# EAGLE design Colon (EAGLE 9.6.2)
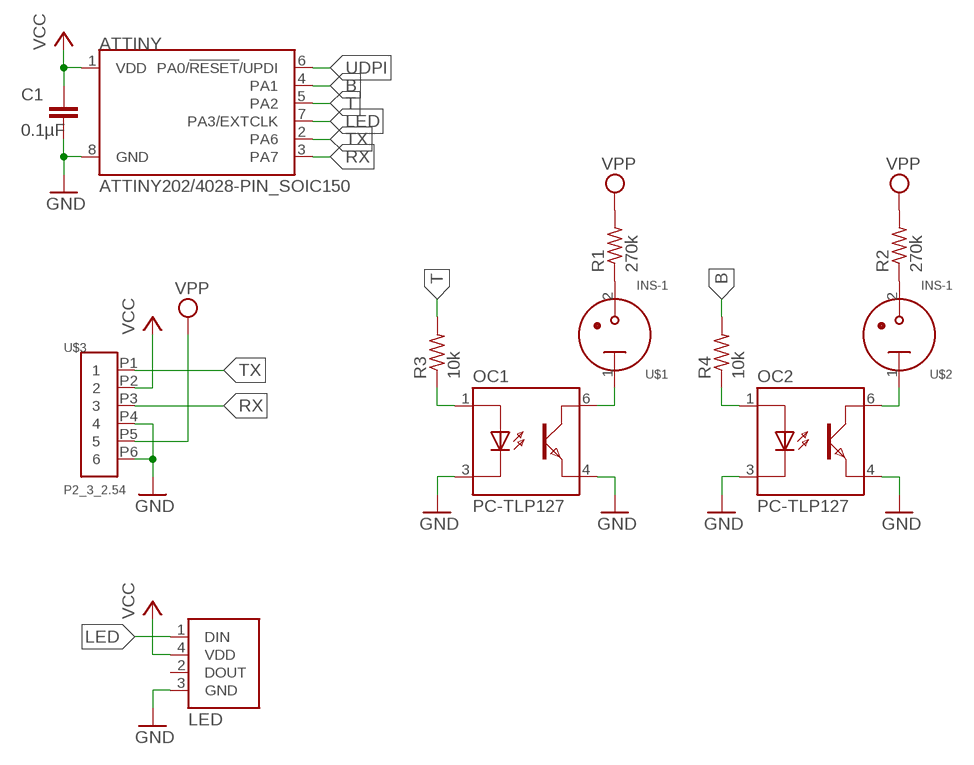
[diagram p0: schematic, sheet 1]

## Parts
ATTINY  ATTINY202/4028-PIN_SOIC150  [SOIC127P600X175-8N]
C1  0.1µF  C-EUC0603  [C0603]
LED  SK6812SIDE  [SK6812SIDE]
OC1  PC-TLP127  [MINIFLAT4]
OC2  PC-TLP127  [MINIFLAT4]
R1  270k  R-US_R0603  [R0603]
R2  270k  R-US_R0603  [R0603]
R3  10k  R-US_R0603  [R0603]
R4  10k  R-US_R0603  [R0603]
U$1  INS-1  [INS-1]
U$2  INS-1  [INS-1]
U$3  P2_3_2.54  [P2_3_2.54]

## Nets
B: ATTINY.4(PA1) R4.2
GND: ATTINY.8(GND) C1.2 LED.3(GND) OC1.3(C) OC1.4(TE) OC2.3(C) OC2.4(TE) U$3.P4 U$3.P6
LED: ATTINY.7(PA3/EXTCLK) LED.1(DIN)
N$1: R1.1 U$1.2(C)
N$2: R2.1 U$2.2(C)
N$3: OC1.6(TC) U$1.1(A)
N$4: OC2.6(TC) U$2.1(A)
N$7: OC2.1(A) R4.1
N$8: OC1.1(A) R3.1
RX: ATTINY.3(PA7) U$3.P3
T: ATTINY.5(PA2) R3.2
TX: ATTINY.2(PA6) U$3.P1
UDPI: ATTINY.6(PA0/!RESET!/UPDI)
VCC: ATTINY.1(VDD) C1.1 LED.4(VDD) U$3.P2
VPP: R1.2 R2.2 U$3.P5
Unconnected: LED.2(DOUT)

## Library data of the parts
ATTINY = microcontrollers:ATTINY202/402
C1 = rcl:C-EU: CAPACITOR, European symbol; SPICEPREFIX: C
LED = chip:SK6812SIDE
OC1 OC2 = we-opto:PC: Photocoupler / Photointerrupter TLP127 compatible with TLP187 and LTV-352T; DIGIKEY: TLP127FDKR-ND
R1-R4 = rcl:R-US_: RESISTOR, American symbol; SPICEPREFIX: R
U$1 U$2 = nixie-tube:INS-1
U$3 = pins:P2_3_2.54

## Board
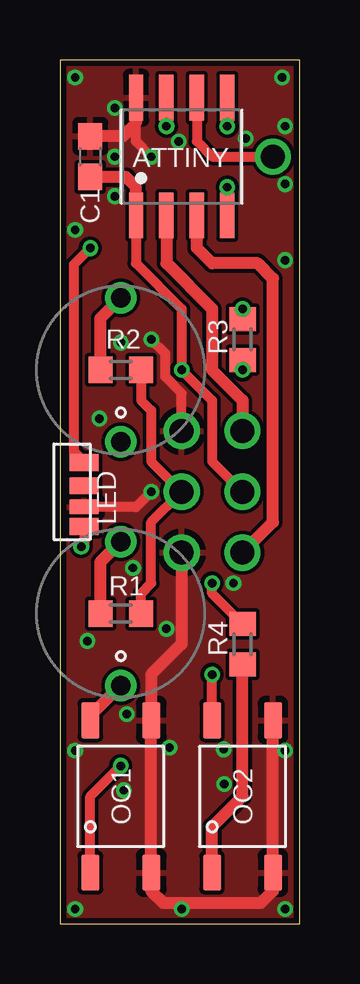
[diagram p1: board, top side]
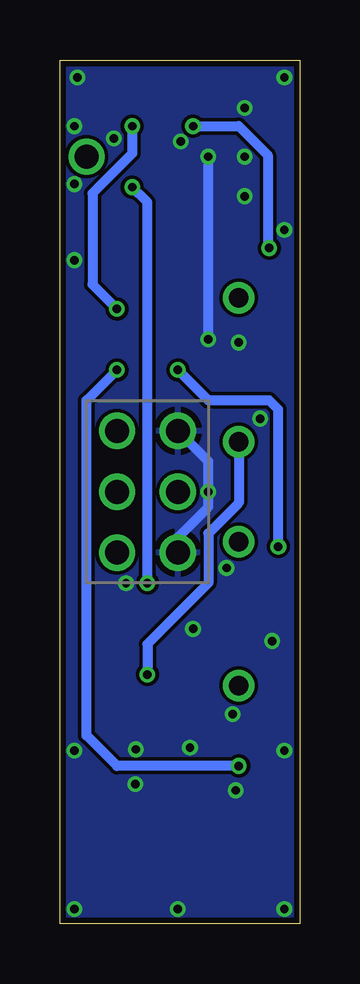
[diagram p2: board, bottom side, seen from below]

Size 10 x 36 mm. Coordinates in mm from the lower left corner, seen from the top.
Outline: 0,0 10,0 10,36 0,36 0,0
Copper layers (1*16): Top 0.035mm / dielectric 1.5mm / Bottom 0.035mm
Design rules "SeeedStudio_2layer_DRU_no_angle_20140221": minimum track width 6mil, minimum drill 12mil, track to track 6mil, track to pad 6mil, pad to pad 6mil, via to via 6mil, smd to smd 0mil, copper to edge 10mil, drill to drill 10mil, minimum pad ring 10mil, minimum via ring 6mil, stop-mask expansion 2mil, vias tented up to drill 100mil, thermal gap 10mil

### Footprints (pad centres in the part's own frame; a part is rotated, then mirrored left to right if it is on the bottom)
SOIC127P600X175-8N = smd 1.901 x 0.599: 1 -2.455,1.905; 2 -2.455,0.635; 3 -2.455,-0.635; 4 -2.455,-1.905; 5 2.455,-1.905; 6 2.455,-0.635; 7 2.455,0.635; 8 2.455,1.905
C0603 = smd 1.1 x 1: 1 -0.85,0; 2 0.85,0
SK6812SIDE = smd 0.7 x 1.2: 1 -1.225,0.508; 2 -0.25,0.508; 4 1.45,0.508 | smd 0.6 x 1.2: 3 0.625,0.508
MINIFLAT4 = smd 1.524 x 0.762: 1 -3.175,1.27; 3 -3.175,-1.27; 4 3.175,-1.27; 6 3.175,1.27
R0603 = smd 1 x 1.1: 1 -0.85,0; 2 0.85,0
INS-1 = drill 0.8: 1 0,3; 2 0,-3
P2_3_2.54 = drill 1: P1 -1.27,2.54; P2 -1.27,0; P3 -1.27,-2.54; P4 1.27,2.54; P5 1.27,0; P6 1.27,-2.54

### Placement (x,y rotation side)
ATTINY  5.08,31.97 90 top
C1  1.27,31.97 90 top
LED  0.51,18 270 top
OC1  2.54,5.3 90 top
OC2  7.62,5.3 90 top
R1  2.54,12.92 0 top
R2  2.54,23.08 0 top
R3  7.62,24.35 90 top
R4  7.62,11.65 90 top
U$1  2.54,12.92 180 top
U$2  2.54,23.08 180 top
U$3  6.35,18 0 bottom

### Tracks (layer width: path | path; a pad name or v marks a point on that pad's centre or on a via)
B  (via drill 0.35)
  Top 0.406: R4.2 6.35,13.77 v6.35,14.19 | ATTINY.4 v6.99,30.7
  Bottom 0.406: v6.99,30.7 6.35,30.06 v6.35,14.19
GND  (via drill 0.35)
  Top 0.406: LED.3 1.03,17.36 3.17,17.36 v3.81,18 | v3.81,24.35 4.4,23.76 4.4,22.8 5.08,22.11 U$3.P4 | v3.81,31.97 3.17,32.61 3.17,33.37
  Top 0.508: ATTINY.8 3.17,33.37 2.63,32.82 C1.2 | OC2.4 OC2.3 8.89,1.36 8.38,0.86 4.32,0.86 3.81,1.36 OC1.3 OC1.4 3.81,10.38 5.08,11.65 U$3.P6
  Bottom 0.406: U$3.P6 5.08,16.09 3.81,17.36 v3.81,18 3.81,19.27 U$3.P4 | v3.81,24.35 v3.81,31.97
  other vias: 9.27,35.27 9.4,33.24 7.75,32.73 9.4,30.83 4.95,32.61 2.29,34 0.64,35.27 2.29,31.97 2.29,30.32 0.64,28.92 9.4,27.65 2.54,24.22 1.65,21.05 3.05,14.82 1.14,11.78 4.45,12.29 7.24,14.19 6.86,5.81 9.4,7.21 6.84,7.26 4.57,7.33 0.64,7.21 2.79,8.73 2.67,5.55 0.64,0.6 5.08,0.6 9.4,0.6
  pour Top: -1.27,37.05 10.16,37.05 10.16,-1.05 -1.27,-1.05
  pour Bottom: -1.27,37.05 11.43,37.05 11.43,-1.05 10.16,-1.05 -1.27,-1.05
LED  (via drill 0.35)
  Top 0.406: LED.1 0.59,19.65 0.59,27.48 v1.27,28.16 | ATTINY.7 v4.45,33.24
  Bottom 0.406: v4.45,33.24 2.54,33.24 1.33,32.03 1.33,28.22 v1.27,28.16
N$1
  Top 0.508: R1.1 1.69,15.07 U$1.2
N$2
  Top 0.508: R2.1 1.69,25.23 U$2.2
N$3
  Top 0.508: OC1.6 1.27,8.65 U$1.1
N$4  (via drill 0.35)
  Top 0.406: OC2.6 v6.35,10.38
  Bottom 0.406: U$2.1 2.54,17.54 3.81,16.27 3.81,14.19 6.35,11.65 v6.35,10.38
N$7
  Top 0.508: OC2.1 6.35,4.03 7.62,5.3 R4.1
N$8  (via drill 0.35)
  Top 0.406: OC1.1 1.27,5.3 v2.54,6.57 | R3.1 v7.62,23.08
  Bottom 0.406: v2.54,6.57 7.62,6.57 8.89,7.84 8.89,21.81 v7.62,23.08
RX
  Top 0.508: U$3.P3 8.89,16.73 8.89,26.89 8.26,27.52 6.35,27.52 5.71,28.16 ATTINY.3
T  (via drill 0.35)
  Top 0.406: R3.2 v7.62,25.62 | ATTINY.5 v6.99,33.24
  Bottom 0.406: v7.62,25.62 8.64,26.64 8.64,30.45 6.99,32.1 v6.99,33.24
TX
  Top 0.508: ATTINY.2 4.45,27.52 6.35,25.62 6.35,23.08 7.62,21.81 U$3.P1
UDPI  (via drill 1)
  Top 0.406: ATTINY.6 5.71,32.61 6.35,31.97 v8.89,31.97
VCC  (via drill 0.35)
  Top 0.406: ATTINY.1 3.17,27.52 5.08,25.62 v5.08,23.08 6.35,21.81 6.35,19.27 U$3.P2 | LED.4 1.02,15.84 v0.89,15.71
  Top 0.508: ATTINY.1 3.17,30.7 2.75,31.12 C1.1
  Bottom 0.406: v0.89,15.71 0.89,21.43 1.27,21.81 3.81,21.81 v5.08,23.08
VPP
  Top 0.406: R1.2 3.39,13.77 3.81,14.19 3.81,16.73 U$3.P5 3.81,19.27 3.81,21.39 3.39,21.81 R2.2

### Text on the board
bStop: Designed by @fujiy0, 2020